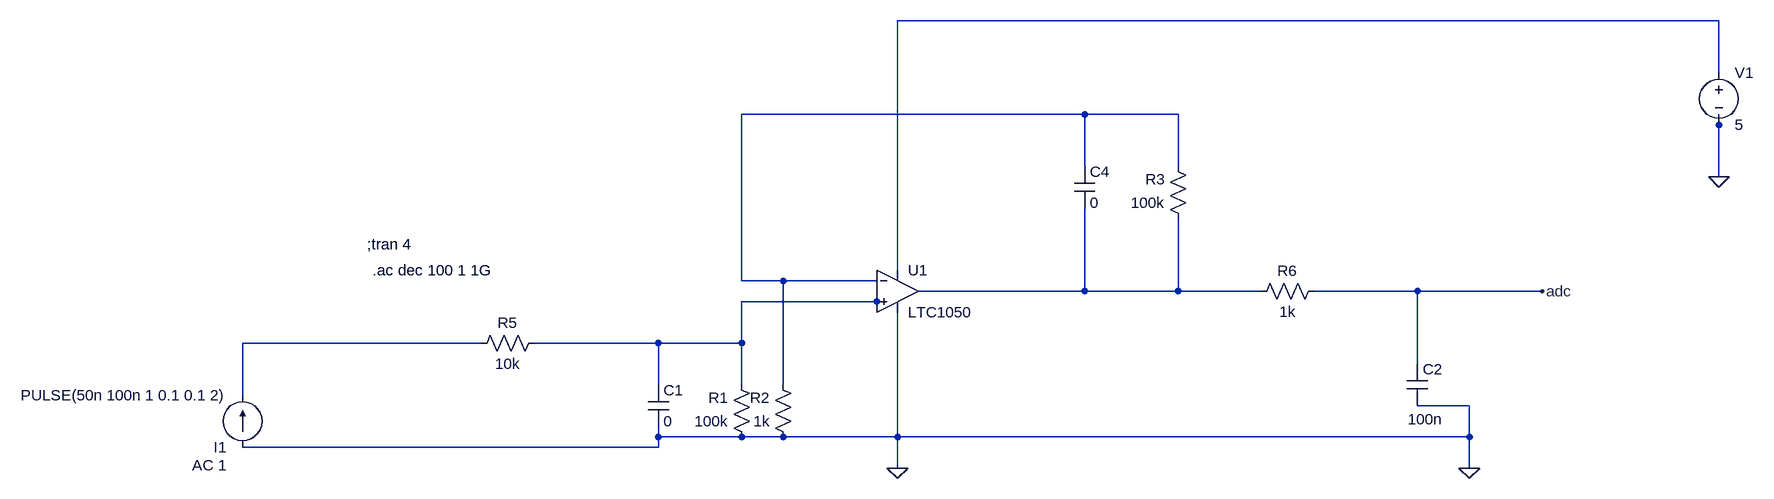
[diagram p0: schematic Draft2.asc]
Draft2.asc, the LTspice schematic file:
Version 4
SHEET 1 1864 680
WIRE 1536 -688 272 -688
WIRE 1536 -608 1536 -688
WIRE 560 -544 32 -544
WIRE 704 -544 560 -544
WIRE 1536 -528 1536 -544
WIRE 560 -464 560 -544
WIRE 704 -464 704 -544
WIRE 1536 -448 1536 -528
WIRE 272 -304 272 -688
WIRE 32 -288 32 -544
WIRE 96 -288 32 -288
WIRE 240 -288 96 -288
WIRE 560 -272 560 -400
WIRE 560 -272 304 -272
WIRE 704 -272 704 -384
WIRE 704 -272 560 -272
WIRE 832 -272 704 -272
WIRE 1072 -272 912 -272
WIRE 1264 -272 1072 -272
WIRE 240 -256 32 -256
WIRE 256 -256 240 -256
WIRE -368 -192 -736 -192
WIRE -96 -192 -288 -192
WIRE 32 -192 32 -256
WIRE 32 -192 -96 -192
WIRE 1072 -160 1072 -272
WIRE -96 -128 -96 -192
WIRE 32 -128 32 -192
WIRE 96 -128 96 -288
WIRE -736 -112 -736 -192
WIRE 1152 -96 1072 -96
WIRE -96 -48 -96 -64
WIRE 32 -48 -96 -48
WIRE 96 -48 32 -48
WIRE 272 -48 272 -240
WIRE 272 -48 96 -48
WIRE 1152 -48 1152 -96
WIRE 1152 -48 272 -48
WIRE -96 -32 -96 -48
WIRE -96 -32 -736 -32
WIRE 272 0 272 -48
WIRE 1152 0 1152 -48
FLAG 1536 -448 0
FLAG 1152 0 0
FLAG 272 0 0
FLAG 1264 -272 adc
SYMBOL res -272 -208 R90
WINDOW 0 0 56 VBottom 2
WINDOW 3 32 56 VTop 2
SYMATTR InstName R5
SYMATTR Value 10k
SYMBOL res 48 -32 R180
WINDOW 0 36 76 Left 2
WINDOW 3 36 40 Left 2
SYMATTR InstName R1
SYMATTR Value 100k
SYMBOL res 112 -32 R180
WINDOW 0 36 76 Left 2
WINDOW 3 36 40 Left 2
SYMATTR InstName R2
SYMATTR Value 1k
SYMBOL res 720 -368 R180
WINDOW 0 36 76 Left 2
WINDOW 3 36 40 Left 2
SYMATTR InstName R3
SYMATTR Value 100k
SYMBOL res 816 -256 R270
WINDOW 0 32 56 VTop 2
WINDOW 3 0 56 VBottom 2
SYMATTR InstName R6
SYMATTR Value 1k
SYMBOL cap -112 -128 R0
SYMATTR InstName C1
SYMATTR Value 0
SYMBOL cap 544 -464 R0
SYMATTR InstName C4
SYMATTR Value 0
SYMBOL cap 1056 -160 R0
WINDOW 3 1 85 Left 2
SYMATTR InstName C2
SYMATTR Value 100n
SYMBOL current -736 -32 R180
WINDOW 123 24 -28 Left 2
WINDOW 39 0 0 Left 0
SYMATTR InstName I1
SYMATTR Value PULSE(50n 100n 1 0.1 0.1 2)
SYMATTR Value2 AC 1
SYMBOL OpAmps\\LTC1050 272 -336 R0
SYMATTR InstName U1
SYMBOL voltage 1536 -624 R0
WINDOW 123 0 0 Left 0
WINDOW 39 0 0 Left 0
SYMATTR InstName V1
SYMATTR Value 5
TEXT -544 -344 Left 2 !;tran 4
TEXT -536 -304 Left 2 !.ac dec 100 1 1G

The netlist it stands for:
* Draft2.asc
R5 N004 N005 10k
R1 0 N004 100k
R2 0 N002 1k
R3 N003 N002 100k
R6 N003 adc 1k
C1 N004 0 0
C4 N002 N003 0
C2 adc 0 100n
I1 0 N005 PULSE(50n 100n 1 0.1 0.1 2) AC 1
XU1 N004 N002 N001 0 N003 LTC1050  ; pins In+ In- V+ V- OUT
V1 N001 0 5
;tran 4
.ac dec 100 1 1G
.lib LTC.lib
.backanno
.end